# EAGLE schematic Absolute value circuit (EAGLE 6.2)
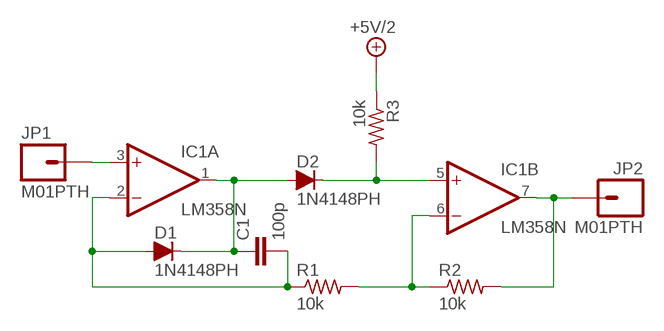
[diagram p0: schematic, sheet 1]

## Parts
C1  100p  C-EU025-025X050  [C025-025X050]
D1  1N4148PH  [DO35-7]
D2  1N4148PH  [DO35-7]
IC1  LM358N  [DIL08]
JP1  M01PTH  [1X01]
JP2  M01PTH  [1X01]
R1  10k  R-US_0204/5  [0204/5]
R2  10k  R-US_0204/5  [0204/5]
R3  10k  R-US_0204/5  [0204/5]

## Nets
+5V/2: R3.1
N$2: D2.C IC1.5(B:+IN) R3.2
N$3: IC1.3(A:+IN) JP1.1
N$4: C1.2 D1.A IC1.2(A:-IN) R1.1
N$5: C1.1 D1.C D2.A IC1.1(A:OUT)
N$6: IC1.7(B:OUT) JP2.1 R2.2
N$7: IC1.6(B:-IN) R1.2 R2.1

## Power pins joined to a net without a drawn wire
V+: IC1.8(P:V+)
V-: IC1.4(P:V-)

## Library data of the parts
C1 = resistor:C-EU: CAPACITOR, European symbol
D1 D2 = JPN:1N4148: DIODE high speed (Philips)
IC1 = linear:LM358: OP AMP also LM158; LM258; LM2904 Source: http://cache.national.com/ds/LM/LM158.pdf
JP1 JP2 = SparkFun:M01: Header 1 Standard 1-pin 0.1" header. Use with straight break away headers (SKU : PRT-00116), right angle break away headers (PRT-00553), swiss pins (PRT-00743), machine pins (PRT-00117), and female headers (PRT-00115).
R1-R3 = rcl:R-US_: RESISTOR, American symbol